# EAGLE design Adafruit LM3671 Buck (EAGLE 6.6.0)
COMPANY: ADAFRUIT INDUSTRIES; DRAWN: KTOWN; REV: A
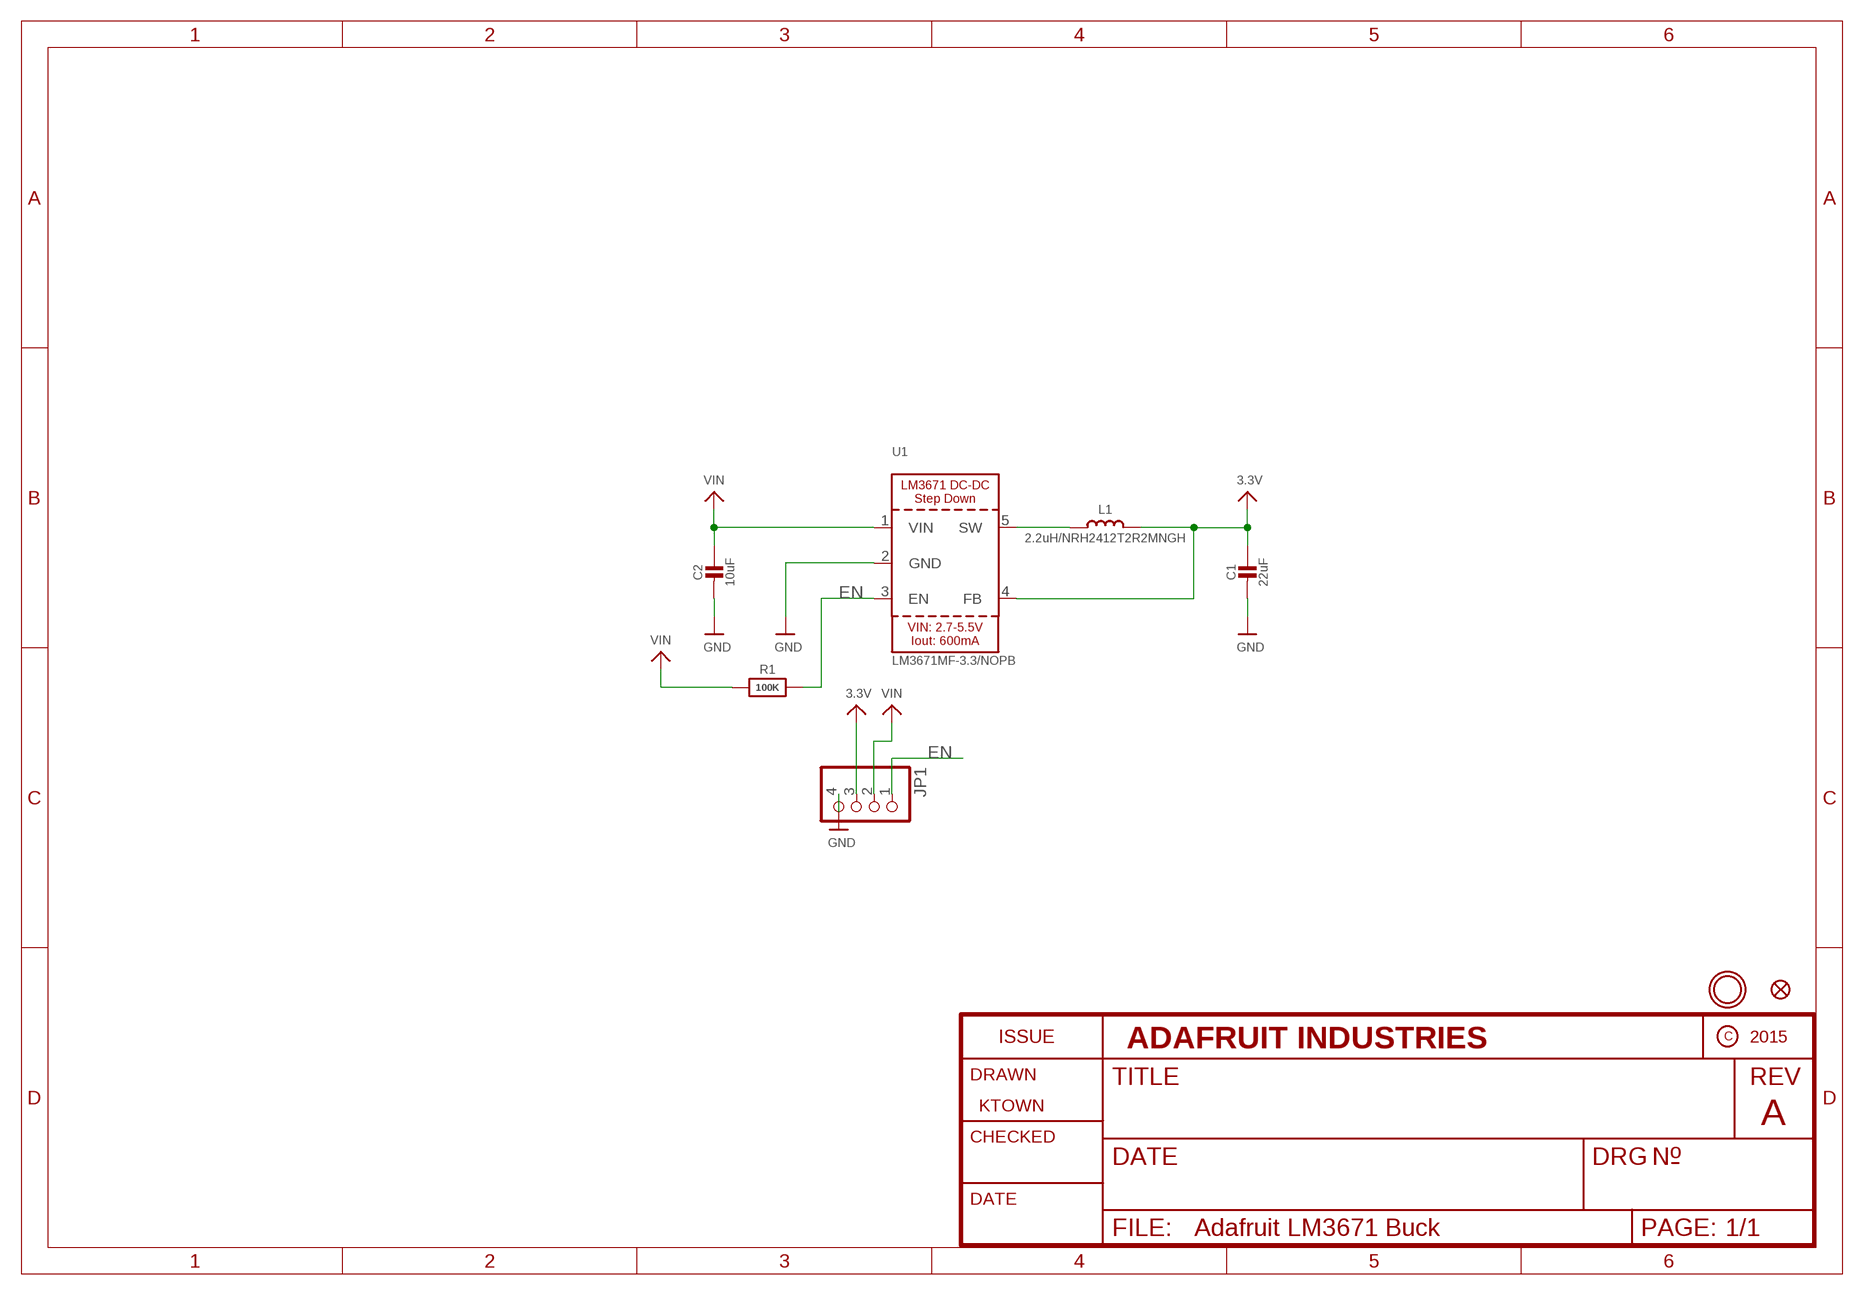
[diagram p0: schematic, sheet 1]

## Parts
C1  22uF  CAP_CERAMIC0805-NOOUTLINE  [0805-NO]
C2  10uF  CAP_CERAMIC0805-NOOUTLINE  [0805-NO]
FID1  FIDUCIAL""  [FIDUCIAL_1MM]
JP1  HEADER-1X4ROUND  [1X04_ROUND]
L1  2.2uH/NRH2412T2R2MNGH  INDUCTORNRH2412T  [INDUCTOR_TAIYOYUDEN_NRH2412T]
R1  100K  RESISTOR0805_NOOUTLINE  [0805-NO]
U1  LM3671MF-3.3/NOPB  VREG_LM3671  [SOT23-5]
U$9  MOUNTINGHOLE2.5  [MOUNTINGHOLE_2.5_PLATED]

## Nets
3.3V: C1.1 JP1.3 L1.2 U1.4(FB)
EN: JP1.1 R1.2 U1.3(EN)
GND: C1.2 C2.2 JP1.4 U1.2(GND)
N$1: L1.1 U1.5(SW)
VIN: C2.1 JP1.2 R1.1 U1.1(VIN)

## Library data of the parts
C1 C2 = microbuilder:CAP_CERAMIC: Ceramic Capacitors For new designs, use the packages preceded by an '_' character since they are more reliable: The following footprints should be used on most boards: _0402 - Standard footprint for regular board layouts _0603 - Standard footprint for regular board layouts _0805 - Standard footprint for regular board layouts _1206 - Standard footprint for regular board layouts For extremely tight-pitch boards where space is at a premium, the following 'micro-pitch' footprints can be used (smaller pads, no silkscreen outline, etc.): _0402MP - Micro-pitch footprint for very dense/compact boards _0603MP - Micro-pitch footprint for very dense/compact boards _0805MP - Micro-pitch footprint for very dense/compact boards _1206MP - Micro-pitch footprint for very dense/compact boards
FID1 = microbuilder:FIDUCIAL: Fiducial Alignment Points Various fiducial points for machine vision alignment.; BOM: EXCLUDE
JP1 = microbuilder:HEADER-1X4: PIN HEADER
L1 = microbuilder:INDUCTOR: Inductors 0603: 10nH Ceramic Inductor - microwire antenna/RF (Digikey: 712-1434-2-ND) 0805: 560nH Ceramic Inductor - RF (Digikey: 553-1047-1-ND) 270nH Ceramic Inductor - Q = 40@250MHz, +-5%, 1 Ohm DC Resistance (Digikey: 535-10506-2-ND) 1007 (2518 Metric) SMT: 10µH 10% 250mOhm 820mA 1007 Inductor (Digikey: 587-2189-1-ND) 22µH 10% 500mOhm 580mA 1007 Inductor (Digikey: 587-2190-1-ND) 47µH 10% 950mOhm 420mA 1007 Inductor (Digikey: 587-2191-1-ND) 47µH 5% 100mOhm 1A 1008 Inductor (Digikey: 732-1816-1-ND) 5.0x5.0mm (Taiyo Yuden NR5040 Series) 6.8µH 20% 2.3A 64mOhm Inductor (Digikey: 587-2374-2-ND) 5.0x5.0mm (TDK VLC5045 Series) 4.7µH 20% 3.3A 34mOhm Inductor (Digikey: 445-6526-1-ND) 6.8µH 20% 2.7A 46mOhm Inductor (Digikey: 445-6527-1-ND) 6.0x6.0mm (TDK VLC6045 Series) 4.7µH 20% 3.8A 27mOhm Inductor (Digikey: 445-6538-2-ND) 6.8µH 20% 3A 41mOhm Inductor (Digikey: 445-6540-1-ND) 6.2µH 30% 2.2A 45mOhm Inductor (Digikey: SRR5028-6R2YCT-ND) - Not TDK VLC6045 but footprint should match 6.0x6.0mm (TDK SLF6045 Series) 6.8uH 30% 2A 33mOhm Inductor (Digikey: 445-4572-1-ND, Mouser: 810-SLF645T6R8N2R0PF) 6.0x6.0mm (Sumida CDRH5D28 Series) 6.2uH 30% 1.8A 45mOhm Inductor (Digikey: 308-1542-1-ND) Taiyo Yuden NR3015T2R2M - 2.2uH 20% 1.5A (Digikey: 587-1648-2-ND, Mouser: 963-NR3015T2R2M) - Used with TI TPS62172 CoilCraft RFID Transponder Coil - MA5532-AE (For use with AS3935 Lightning Sensor) Taiyo Yuden NRH2412T2R2MNGH - 2.2uH 20% 1AA (Digikey: 587-3443-1-ND) - Used with TI LM3671 Vishay IHLP 1.0uH Molded Inductor - 24mOhm DCR, 5A, +/-20%, -55°C-125°C (Digikey: 541-1319-1-ND)
R1 = microbuilder:RESISTOR: Resistors For new designs, use the packages preceded by an '_' character since they are more reliable: The following footprints should be used on most boards: _0402 - Standard footprint for regular board layouts _0603 - Standard footprint for regular board layouts _0805 - Standard footprint for regular board layouts _1206 - Standard footprint for regular board layouts For extremely tight-pitch boards where space is at a premium, the following 'micro-pitch' footprints can be used (smaller pads, no silkscreen outline, etc.): _0402MP - Micro-pitch footprint for very dense/compact boards _0603MP - Micro-pitch footprint for very dense/compact boards _0805MP - Micro-pitch footprint for very dense/compact boards _1206MP - Micro-pitch footprint for very dense/compact boards
U1 = microbuilder:VREG_LM3671: LM3671 - 600mA DC-DC Step-Down Converter VIN: 2.7-5.5V Load Current: 600mA Switching Frequency: 2MHz Iq: 16uA
U$9 = microbuilder:MOUNTINGHOLE: Mounting Hole For #2 screws (0.086"/2.18mm width, 0.094"/2.4mm hole) use 2.5mm; BOM: EXCLUDE

## Board
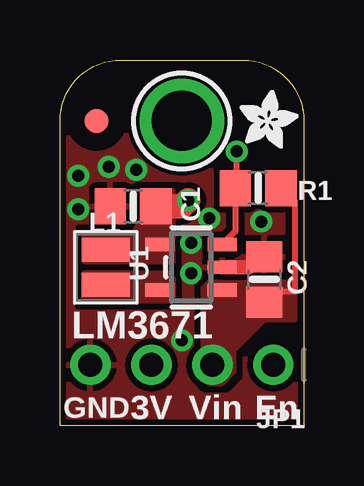
[diagram p1: board, top side]
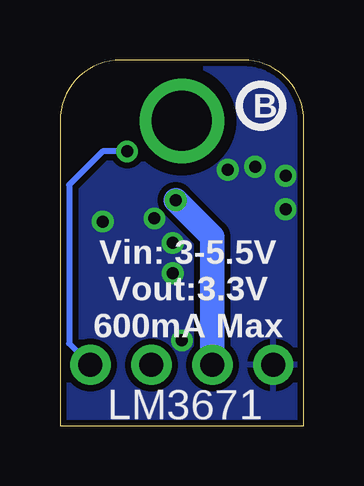
[diagram p2: board, bottom side, seen from below]

Size 10.16 x 15.24 mm. Coordinates in mm from the lower left corner, seen from the top.
Outline: 0,0 0,12.7 arc-90 2.54,15.24 7.62,15.24 arc-90 10.16,12.7 10.16,0 0,0
Copper layers (1*16): Top 0.035mm / dielectric 1.5mm / Bottom 0.035mm
Design rules "adafruit *": minimum track width 8mil, minimum drill 15.5mil, track to track 8mil, track to pad 8mil, pad to pad 8mil, via to via 8mil, smd to smd 8mil, copper to edge 10mil, drill to drill 8mil, minimum pad ring 10mil, minimum via ring 8mil, stop-mask expansion 2mil, vias tented up to drill 20mil, thermal gap 10mil

### Footprints (pad centres in the part's own frame; a part is rotated, then mirrored left to right if it is on the bottom)
0805-NO = smd 1.3 x 1.5: 1 -0.95,0; 2 0.95,0
FIDUCIAL_1MM = smd 1 x 1: 1 0,0
1X04_ROUND = drill 1 pad 1.676: 1 -3.81,0; 2 -1.27,0; 3 1.27,0; 4 3.81,0
INDUCTOR_TAIYOYUDEN_NRH2412T = smd 1 x 2: 1 -0.725,0; 2 0.725,0
SOT23-5 = smd 0.55 x 1.2: 1 -0.95,-1.3; 2 0,-1.3; 3 0.95,-1.3; 4 0.95,1.3; 5 -0.95,1.3
MOUNTINGHOLE_2.5_PLATED = drill 2.5 pad 3.2: P$1 0,0

### Placement (x,y rotation side)
C1  3.05,9.14 180 top
C2  8.51,6.1 90 top
FID1  1.52,12.7 0 top
JP1  5.08,2.54 180 top
L1  1.91,6.6 90 top
R1  8.26,9.91 180 top
U1  5.46,6.6 90 top
U$9  5.08,12.7 0 top
U$10  [PCBFEAT-REV-040]  1.78,13.34 0 bottom
U$11  [ADAFRUIT_2.5MM]  7.49,11.56 0 top

### Tracks (layer width: path | path; a pad name or v marks a point on that pad's centre or on a via)
3.3V  (via drill 0.5)
  Top 1.016: v5.33,9.4 5.08,9.14 C1.1
  Bottom 1.016: JP1.3 3.81,7.87 v5.33,9.4
  pour Top (no thermals): 1.02,8 1.02,6.86 4.7,6.86 4.7,9.78 3.43,9.78 3.43,8.64 3.05,8
EN  (via drill 0.5)
  Top 0.254: U1.3 7.3,8.1 R1.2 7.37,9.97 v7.37,11.43
  Bottom 0.254: v7.37,11.43 8.38,11.43 9.78,10.03 9.78,3.43 JP1.1
GND  (via drill 0.5)
  Top 0.61: U1.2 7.87,6.6 8.51,7.24
  other vias: 8.38,8.51 0.76,10.41 0.76,9.02 5.46,6.35 6.22,8.64 2.03,10.79 3.17,10.67 5.08,3.56 5.46,7.62
  pour Top (isolate 0.254, rank 6): 0,0 0,15.24 10.16,15.24 10.16,0
  pour Bottom (isolate 0.254): 0,0 0,15.24 10.16,15.24 10.16,0
N$1
  pour Top (rank 2, no thermals): 1.02,6.35 4.45,6.35 4.7,6.1 4.7,5.33 4.57,5.21 1.02,5.21
VIN
  Top 0.254: C2.1 8.51,5.59 9.78,5.59 9.78,9.4 9.27,9.91 R1.1
  pour Top (no thermals): 6.22,5.97 5.97,5.71 5.97,2.03 6.22,1.78 6.73,1.78 7.24,2.29 7.24,3.17 8.51,4.45 9.78,4.45 9.78,5.97

### Text on the board
tPlace: LM3671 | GND | 3V | Vin | En
bPlace: Vin: 3-5.5V / Vout:3.3V / 600mA Max | LM3671